# EAGLE schematic single-m0dul (EAGLE 5.11)
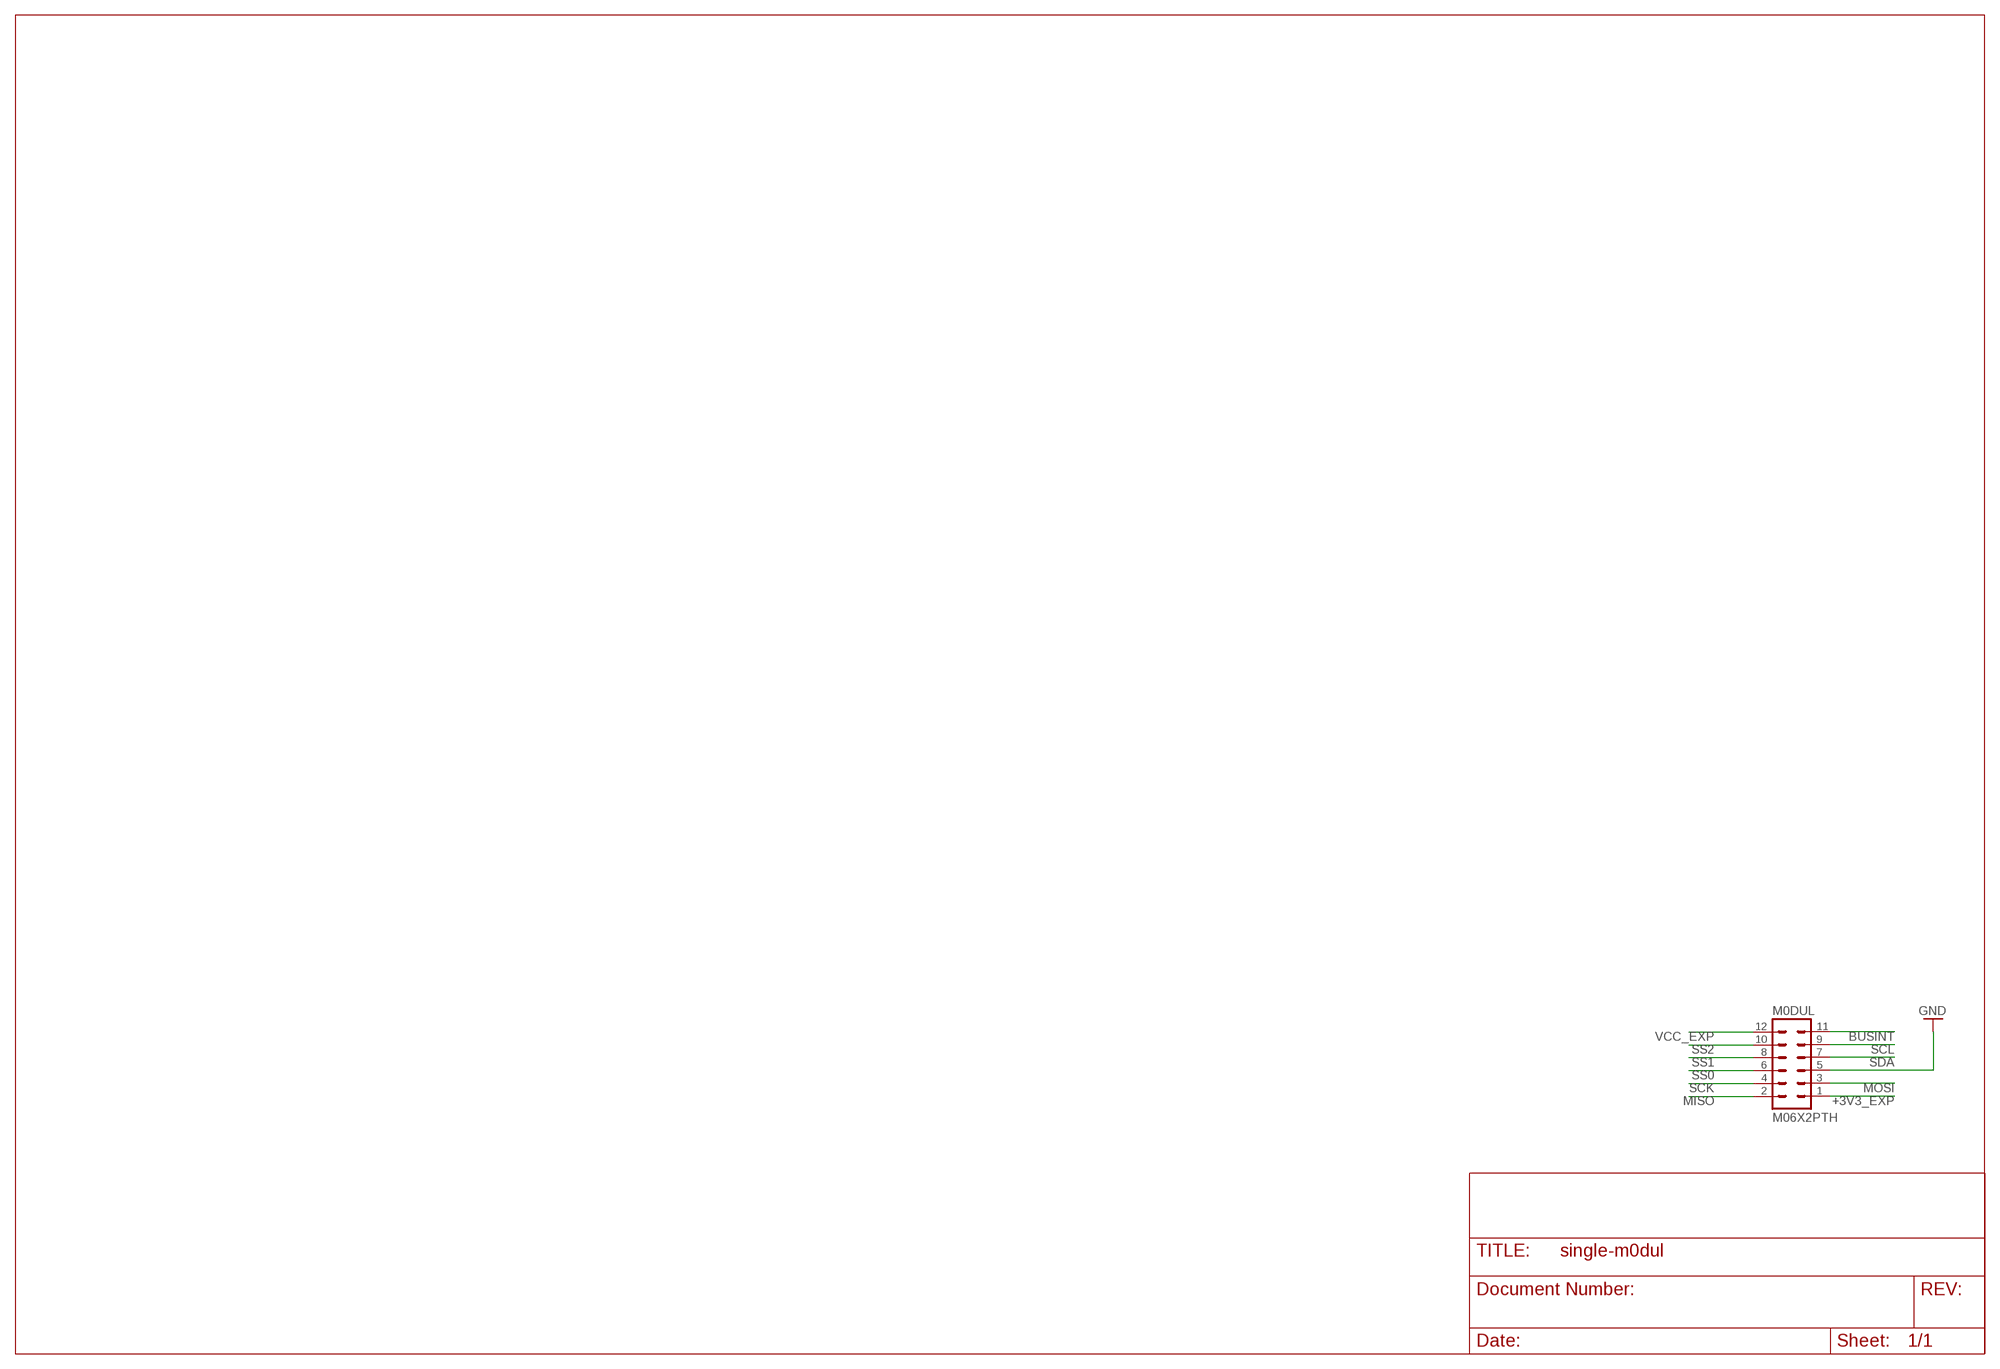
[diagram p0: schematic, sheet 1]

## Parts
M0DUL  M06X2PTH  MA06-2  [MA06-2]

## Nets
+3V3_EXP [FAT]: M0DUL.1
BUSINT: M0DUL.11
GND [GND/3V3]: M0DUL.5
MISO: M0DUL.2
MOSI: M0DUL.3
SCK: M0DUL.4
SCL: M0DUL.9
SDA: M0DUL.7
SS0: M0DUL.6
SS1: M0DUL.8
SS2: M0DUL.10
VCC_EXP [FAT]: M0DUL.12

## Library data of the parts
M0DUL = con-lstb:MA06-2: PIN HEADER; OC_FARNELL: unknown; OC_NEWARK: unknown

## Net classes
1 FAT: width 0.2 mm, drill 0.4 mm
2 GND/3V3: width 0.2 mm, drill 0.4 mm